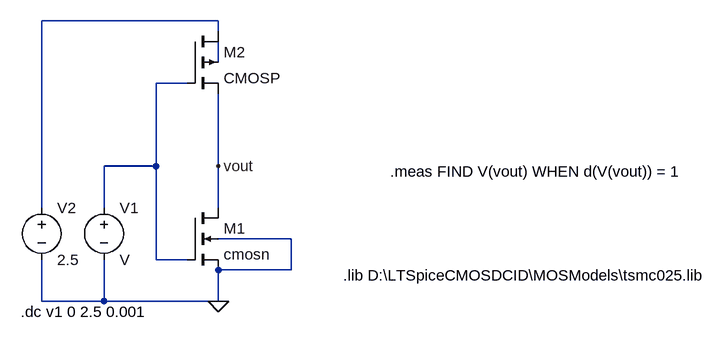
[diagram p0: schematic 250n_and_gate.asc]
250n_and_gate.asc, the LTspice schematic file:
Version 4
SHEET 1 1036 680
WIRE 224 -272 -48 -272
WIRE 224 -256 224 -272
WIRE 224 -208 224 -240
WIRE 176 -176 128 -176
WIRE 128 -48 128 -176
WIRE 128 -48 48 -48
WIRE 224 -48 224 -160
WIRE -48 16 -48 -272
WIRE 48 16 48 -48
WIRE 224 16 224 -48
WIRE 336 64 224 64
WIRE 128 96 128 -48
WIRE 176 96 128 96
WIRE 336 112 336 64
WIRE 336 112 224 112
WIRE -48 160 -48 96
WIRE 48 160 48 96
WIRE 48 160 -48 160
WIRE 224 160 224 112
WIRE 224 160 48 160
FLAG 224 -48 vout
FLAG 224 160 0
SYMBOL nmos4 176 16 R0
SYMATTR InstName M1
SYMATTR Value cmosn
SYMATTR Value2 l=250n w=260n ad=0.1728p as=0.1728p pd=1680n ps=1680n
SYMBOL voltage 48 0 R0
SYMATTR InstName V1
SYMBOL voltage -48 0 R0
WINDOW 123 0 0 Left 0
WINDOW 39 0 0 Left 0
SYMATTR InstName V2
SYMATTR Value 2.5
SYMBOL cmosp 176 -256 R0
SYMATTR InstName M2
SYMATTR Value2 l=250n w=970n ad=0.1728p as=0.1728p pd=1680n ps=1680n
TEXT -80 176 Left 2 !.dc v1 0 2.5 0.001
TEXT 416 120 Left 2 !.lib D:\\LTSpiceCMOSDCID\\MOSModels\\tsmc025.lib
TEXT 488 -40 Left 2 !.meas FIND V(vout) WHEN d(V(vout)) = 1

The netlist it stands for:
* 250n_and_gate.asc
M1 vout N003 0 0 cmosn l=250n w=260n ad=0.1728p as=0.1728p pd=1680n ps=1680n
V1 N003 0 V
V2 N001 0 2.5
M2 N001 N003 vout N002 CMOSP l=250n w=970n ad=0.1728p as=0.1728p pd=1680n ps=1680n
.model NMOS NMOS
.model PMOS PMOS
.lib standard.mos
.dc v1 0 2.5 0.001
.lib D:\LTSpiceCMOSDCID\MOSModels\tsmc025.lib
.meas FIND V(vout) WHEN d(V(vout)) = 1
.backanno
.end